# Altium schematic sheet ControlUnit.SchDoc
size A4; CheckedBy: none; Organization: ORGANIZATION; Address1: ADDRESS 1; Address2: ADDRESS 2; Address3: ADDRESS 3; Address4: ADDRESS 4; Revision: -; SheetNumber: 4; SheetTotal: 4; ENG_APP_DATE: --/--/--; DSN_APP_DATE: --/--/--; CHK_APP_DATE: --/--/--
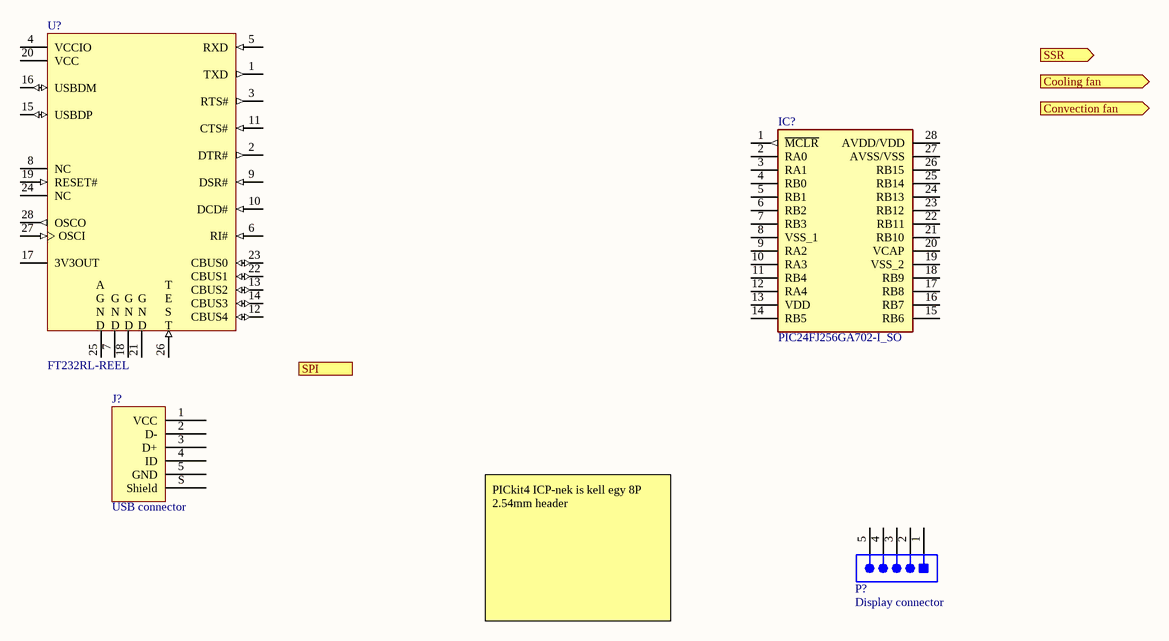
[diagram p0: ControlUnit.SchDoc]

## Parts
IC?  PIC24FJ256GA702-I_SO  [SOIC127P1030X265-28N]
J?  USB connector  [FCI USB 10118193-0001LF]
P?  Display connector  [FCI-77311-5_V]
U?  FT232RL-REEL  [FTDI-SSOP-28_N]

## Ports
Convection fan (out), Cooling fan (out), SPI (harness SPI), SSR (out)

## Nets

Not connected (* = marked no-connect by the designer): IC? 1(~{MCLR}) 2(RA0) 3(RA1) 4(RB0) 5(RB1) 6(RB2) 7(RB3) 8(VSS_1) 9(RA2) 10(RA3) 11(RB4) 12(RA4) 13(VDD) 14(RB5) 15(RB6) 16(RB7) 17(RB8) 18(RB9) 19(VSS_2) 20(VCAP) 21(RB10) 22(RB11) 23(RB12) 24(RB13) 25(RB14) 26(RB15) 27(AVSS/VSS) 28(AVDD/VDD); J? 1(VCC) 2(D-) 3(D+) 4(ID) 5(GND) S(Shield); P? 1(DTR) 2(RXI) 3(TXO) 4(VCC) 5(CTS); U? 1(TXD) 2(DTR#) 3(RTS#) 4(VCCIO) 5(RXD) 6(RI#) 7(GND) 8(NC) 9(DSR#) 10(DCD#) 11(CTS#) 12(CBUS4) 13(CBUS2) 14(CBUS3) 15(USBDP) 16(USBDM) 17(3V3OUT) 18(GND) 19(RESET#) 20(VCC) 21(GND) 22(CBUS1) 23(CBUS0) 24(NC) 25(AGND) 26(TEST) 27(OSCI) 28(OSCO)

## Notes on the sheet
- PICkit4 ICP-nek is kell egy 8P 2.54mm header
- Project:
- Title:
- Drawn by:
- Date and time:
- Checked by:
- Budapest University of Technology and Economics
- Faculty of Electrical Engineering and Informatics
- Sheet
- of
- Size:
- A4
- Revision:
- (in symbol CMP-015-00000-1) A / G / N / D; G / N / D; T / E / S / T

## Library data of the parts
IC? = PIC24FJ256GA702-I_SO: Integrated Circuit; Manufacturer_Name: Microchip; Manufacturer_Part_Number: PIC24FJ256GA702-I/SO; Datasheet Link: https://componentsearchengine.com/Datasheets/2/PIC24FJ256GA702-I_SO.pdf; Height: 2.65mm; Mouser Part Number: 579-24FJ256GA702ISO; Mouser Price/Stock: https://www.mouser.co.uk/ProductDetail/Microchip-Technology/PIC24FJ256GA702-I-SO/?qs=tOTLKpwhCJexnk7mtThrsA%3D%3D; Arrow Part Number: PIC24FJ256GA702-I/SO; Arrow Price/Stock: https://www.arrow.com/en/products/pic24fj256ga702-iso/microchip-technology
J? = 10118193-0001LF: CONN RCPT USB2.0 MICRO B SMD R/A; Manufacturer: Amphenol ICC (FCI); Connector Type: USB - micro B; Current Rating (Amps): 1.8A per Contact; Gender: Receptacle; Mating Cycles: 10000; Number of Contacts: 5; Number of Ports: 1; Shielding: Shielded; Voltage - Rated: 100VAC; Part Number: 10118193-0001LF; ComponentLink1Description: Datasheet; ComponentLink1URL: https://cdn.amphenol-icc.com/media/wysiwyg/files/documentation/datasheet/inputoutput/io_usb_micro.pdf; ComponentLink2Description: DigiKey Link; ComponentLink2URL: //digikey.com/product-detail/en/amphenol-icc-fci/10118193-0001LF/609-4616-2-ND/2785388; Features: Solder Retention; LastUpdated: 2019. 12. 09. 20:51:28; Lifecycle Status: 0; Minimum Order: 1; Mounting Feature: Horizontal; Mounting Type: Surface Mount, Right Angle; Through Hole; Operating Temperature: -30°C ~ 80°C; Packaging: TapeAndReel; Part Status: Active; Price: 0.21; Series: -; Specifications: USB 2.0; Supplier 1: DigiKey; Supplier Part Number 1: 609-4616-2-ND; Termination: Solder
P? = CMP-1698-00006-1: Male Header, Pitch 2.54 mm, 1 x 5 Position, Height 16.24 mm, Tail Length 3.05 mm, / -65 to 125 degC, RoHS, Tape and Reel; Shielding: Shielded; Current Rating: 1 A; Gender: Female; ComponentLink2URL: http://portal.fciconnect.com/Comergent//fci/drawing/77311.pdf; ComponentLink1URL: http://portal.fciconnect.com/; ComponentLink2Description: Datasheet; Max Operating Temperature: 85degC; Package Quantity: 500; PackageDescription: Male Header, Pitch 2.54 mm, 1 x 5 Position, Height 16.24 mm, Tail Length 3.05 mm; ComponentLink1Description: Manufacturer URL; Min Operating Temperature: -25degC; Contact Material: Brass; PackageReference: 77311-5; RoHSCompliant: True; Packaging: Tape and Reel; DatasheetVersion: Rev. CK, 07/2016
U? = CMP-015-00000-1: USB UART IC, -0.5 to 6 V, 24 mA, -40 to 85 degC, 28-Pin SSOP, RoHS, Tape and Reel; Manufacturer: Future Technology Devices International (FTDI); Max Supply Voltage: 5.25V; Data Rate: 3Mbps; Nominal Supply Voltage: 5V; Min Supply Voltage: 3.3V; Channels: 1; Case/Package: SSOP; RoHS Compliant: True; Min Operating Temperature: -40°C; Manufacturer URL: http://www.ftdichip.com/; Pins: 16; Datasheet URL: http://datasheet.octopart.com/FT232RL-FTDI-datasheet-120501.pdf; Packaging: TapeandReel; Package Quantity: 2000; Datasheet Version: Rev. 1.04, 02/2006; Max Operating Temperature: 85°C; Interface: UART